# EAGLE design Ampel (EAGLE 7.6.0)
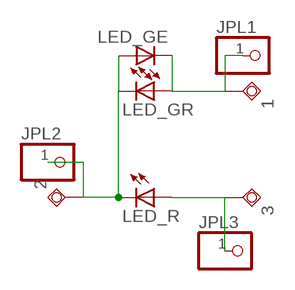
[diagram p0: schematic, sheet 1]

## Parts
1  1  TPSQTP10SQ  [TP10SQ]
2  2  TPSQTP10SQ  [TP10SQ]
3  3  TPSQTP10SQ  [TP10SQ]
JPL1  PINHD-1X1KL  [1X01_KL]
JPL2  PINHD-1X1KL  [1X01_KL]
JPL3  PINHD-1X1KL  [1X01_KL]
LED_GE  LEDCHIP_-LED0402  [CHIP-LED0402]
LED_GR  LEDCHIP_-LED0402  [CHIP-LED0402]
LED_R  LEDCHIP_-LED0402  [CHIP-LED0402]

## Nets
N$1: 1.TP JPL1.1 LED_GE.C LED_GR.A
N$3: 2.TP JPL2.1 LED_GE.A LED_GR.C LED_R.C
N$7: 3.TP JPL3.1 LED_R.A

## Library data of the parts
1-3 = testpad:TPSQ: Test pad
JPL1-JPL3 = pinhead:PINHD-1X1: PIN HEADER
LED_GE LED_GR LED_R = led:LED: LED OSRAM: - CHIPLED LG R971, LG N971, LY N971, LG Q971, LY Q971, LO R971, LY R971 LH N974, LH R974 LS Q976, LO Q976, LY Q976 LO Q996 - Hyper CHIPLED LW Q18S LB Q993, LB Q99A, LB R99A - SideLED LS A670, LO A670, LY A670, LG A670, LP A670 LB A673, LV A673, LT A673, LW A673 LH A674 LY A675 LS A676, LA A676, LO A676, LY A676, LW A676 LS A679, LY A679, LG A679 - Hyper Micro SIDELED® LS Y876, LA Y876, LO Y876, LY Y876 LT Y87S - SmartLED LW L88C, LW L88S LB L89C, LB L89S, LG L890 LS L89K, LO L89K, LY L89K LS L896, LA L896, LO L896, LY L896 - TOPLED LS T670, LO T670, LY T670, LG T670, LP T670 LSG T670, LSP T670, LSY T670, LOP T670, LYG T670 LG T671, LOG T671, LSG T671 LB T673, LV T673, LT T673, LW T673 LH T674 LS T676, LA T676, LO T676, LY T676, LB T676, LH T676, LSB T676, LW T676 LB T67C, LV T67C, LT T67C, LS T67K, LO T67K, LY T67K, LW E67C LS E67B, LA E67B, LO E67B, LY E67B, LB E67C, LV E67C, LT E67C LW T67C LS T679, LY T679, LG T679 LS T770, LO T770, LY T770, LG T770, LP T770 LB T773, LV T773, LT T773, LW T773 LH T774 LS E675, LA E675, LY E675, LS T675 LS T776, LA T776, LO T776, LY T776, LB T776 LHGB T686 LT T68C, LB T68C - Hyper Mini TOPLED® LB M676 - Mini TOPLED Santana® LG M470 LS M47K, LO M47K, LY M47K Source: http://www.osram.convergy.de LUXEON: - LUMILED® LXK2-PW12-R00, LXK2-PW12-S00, LXK2-PW14-U00, LXK2-PW14-V00 LXK2-PM12-R00, LXK2-PM12-S00, LXK2-PM14-U00 LXK2-PE12-Q00, LXK2-PE12-R00, LXK2-PE12-S00, LXK2-PE14-T00, LXK2-PE14-U00 LXK2-PB12-K00, LXK2-PB12-L00, LXK2-PB12-M00, LXK2-PB14-N00, LXK2-PB14-P00, LXK2-PB14-Q00 LXK2-PR12-L00, LXK2-PR12-M00, LXK2-PR14-Q00, LXK2-PR14-R00 LXK2-PD12-Q00, LXK2-PD12-R00, LXK2-PD12-S00 LXK2-PH12-R00, LXK2-PH12-S00 LXK2-PL12-P00, LXK2-PL12-Q00, LXK2-PL12-R00 Source: www.luxeon.com KINGBRIGHT: KA-3528ASYC Source: www.kingbright.com

## Net classes
0 default: clearance 0.205 mm

## Board
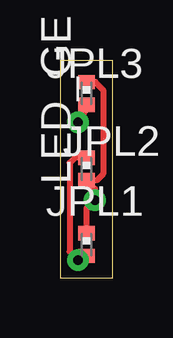
[diagram p1: board, top side]
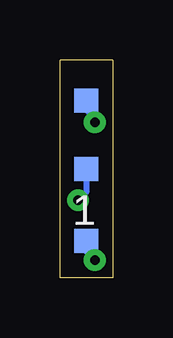
[diagram p2: board, bottom side, seen from below]

Size 2.2 x 9.1 mm. Coordinates in mm from the lower left corner, seen from the top.
Outline: 0,9.1 0,0 2.2,0 2.2,9.1 0,9.1
Copper layers (1*16): Top 0.035mm / dielectric 1.5mm / Bottom 0.035mm
Design rules "SeeedStudio_2layer_DRU_no_angle_20140221": minimum track width 6mil, minimum drill 12mil, track to track 6mil, track to pad 6mil, pad to pad 6mil, via to via 6mil, smd to smd 0mil, copper to edge 10mil, drill to drill 10mil, minimum pad ring 10mil, minimum via ring 6mil, stop-mask expansion 2mil, vias tented up to drill 100mil, thermal gap 10mil

### Footprints (pad centres in the part's own frame; a part is rotated, then mirrored left to right if it is on the bottom)
TP10SQ = smd 1 x 1: TP 0,0
1X01_KL = drill 0.4: 1 0,0
CHIP-LED0402 = smd 0.7 x 0.6: A 0,-0.475; C 0,0.475

### Placement (x,y rotation side)
1  1.1,1.55 0 bottom
2  1.1,4.55 0 bottom
3  1.1,7.4 0 bottom
JPL1  0.75,0.75 0 top
JPL2  1.45,3.25 0 top
JPL3  0.75,6.5 0 top
LED_GE  1.1,4.55 0 top
LED_GR  1.1,1.4 0 top
LED_R  1.1,7.7 0 top

### Tracks (layer width: path | path; a pad name or v marks a point on that pad's centre or on a via)
N$1
  Top 0.254: LED_GR.A 0.93,0.93 JPL1.1 0.4,1.1 0.4,4.8 0.62,5.03 LED_GE.C
  Bottom 0.254: 1.TP 1.1,1.1 JPL1.1
N$3
  Top 0.254: LED_GR.C 1.11,2.91 JPL2.1 1.45,3.73 LED_GE.A 1.52,4.08 1.8,4.35 1.8,7.85 1.48,8.18 LED_R.C
  Bottom 0.254: 2.TP 1.1,3.6 JPL2.1
N$7
  Top 0.254: LED_R.A 1.1,7.05 JPL3.1
  Bottom 0.254: 3.TP 1.1,7.05 JPL3.1

### Text on the board
tValues: Ampel